# Altium schematic sheet THERMO_SENSOR.SchDoc: =DocumentName
size 297 x 209 mm; CompanyName: "AS Manufacturing" LLC; Organization: "AS Manufacturing" LLC; Address1: 5 Sklyarenka St.; Address2: Kyiv 04073; Address3: Ukraine; Address4: https://ajax.systems/en/; DocumentNumber: 3; SheetNumber: 3; SheetTotal: 7; Template_version: 1.0.1
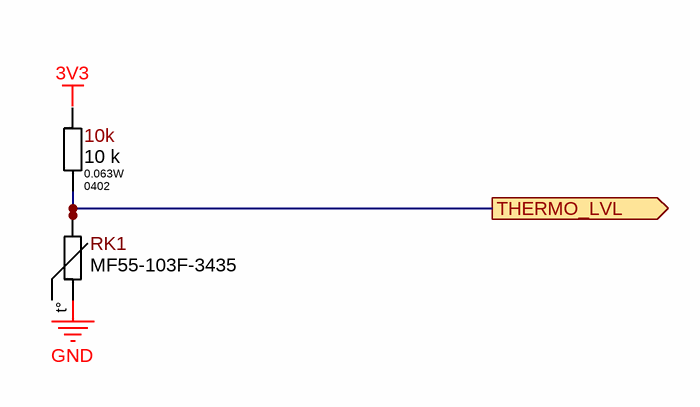
[diagram p0: THERMO_SENSOR.SchDoc]

## Parts
10k  10 k  Power Rating: 0.063W  Package/Case: 0402  [R0402]
RK1  MF55-103F-3435  [MF55-103F-3435]

## Ports
THERMO_LVL (out)

## Nets
GND: RK1.2
THERMO_LVL: 10k.1 RK1.1 ; port THERMO_LVL

Not connected (* = marked no-connect by the designer): 10k 2

## Notes on the sheet
- Labels drawn without touching a wire or pin: 3V3
- 1
- 2
- 3
- 4
- 5
- 6
- C
- D
- E
- F
- Назва проекту
- Мова
- UA
- Розробник
- Формат
- A4
- Версія
- Дата
- Лист
- /
- (in symbol MF55-103F-3435) t°

## Library data of the parts
10k = 10 k  R0402: RES SMD 10 k OHM  ±1% 1/16W 0402; Name Component: Resistror; Operation Temperature: -55℃ to 155℃; Temperature Coefficient: ±100 ppm/°C; Library Path 1: Resistor.SchLib; Part Number: 10 k  R0402; Value: 10 k; Tolerance: ±1%
RK1 = MF55-103F-3435: 10 kOhm ±1% Thermistors, Radial Leaded, 3435 K B Parameter, 28.5x3.6mm, Max 0.6mm Thickness; Manufacturer: Dongguan Tianrui Electronics Co; Ajax_1C_ID: 44964; Ajax_1C_PN: MF55-103F-3435 thermistor probe 10k ±1% 3.6*28.5mm Tianrui; Ajax_1С_Status: Mass Production; Component Status: Released; Replacement: NONE; GUID_1C: bce193fe-f38d-11ec-a361-005056994834; Part Number: MF55-103F-3435; Part Type: Thermistor; Component Type: PTH; Temperature Range: -40°C ~ 105°C; ComponentLink1URL: \\altiumdb.ajax.local\files\Datasheet\Miscellaneous\MF55-103F-3435.pdf; Price: 0.13; ComponentLink1Description: Datasheet